# Altium schematic sheet buttons.SchDoc
size A3
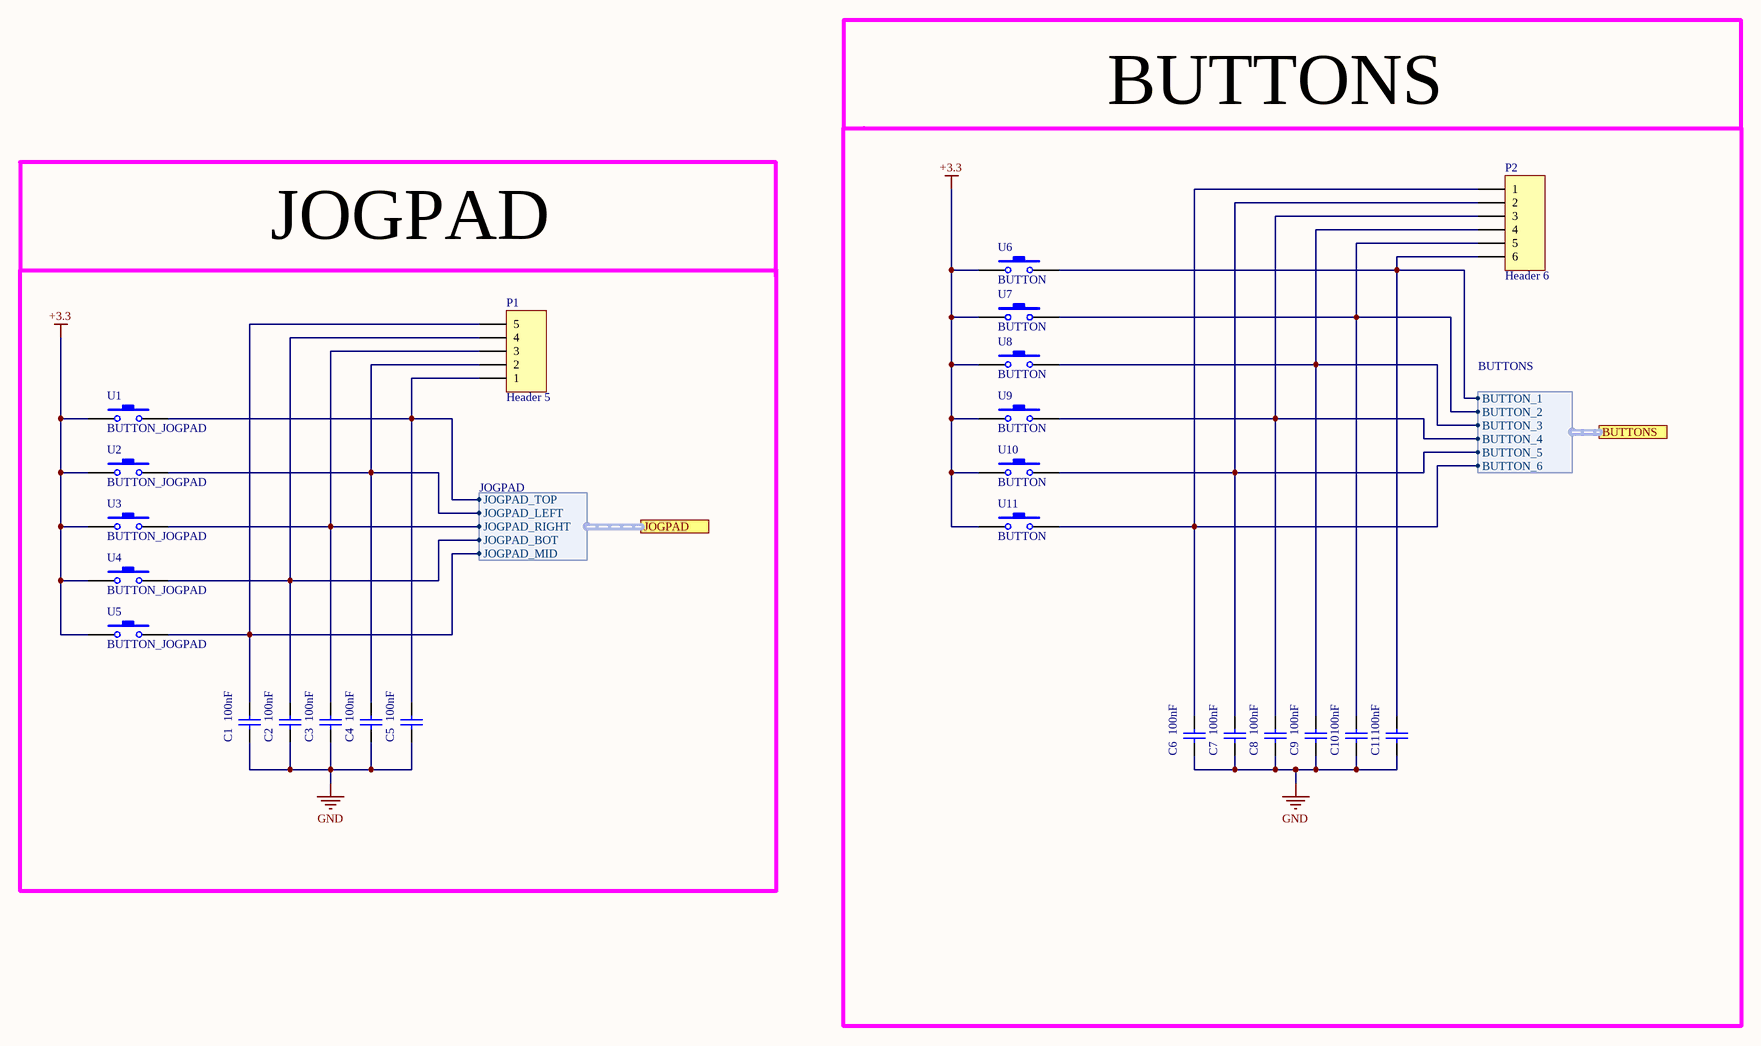
[diagram p0: buttons.SchDoc]

## Parts
C1  100nF  [CAP_0402i_1005m -N]
C2  100nF  [CAP_0402i_1005m -N]
C3  100nF  [CAP_0402i_1005m -N]
C4  100nF  [CAP_0402i_1005m -N]
C5  100nF  [CAP_0402i_1005m -N]
C6  100nF  [CAP_0402i_1005m -N]
C7  100nF  [CAP_0402i_1005m -N]
C8  100nF  [CAP_0402i_1005m -N]
C9  100nF  [CAP_0402i_1005m -N]
C10  100nF  [CAP_0402i_1005m -N]
C11  100nF  [CAP_0402i_1005m -N]
P1  Header 5  [HDR1X5]
P2  Header 6  [HDR1X6]
U1  BUTTON_JOGPAD  [JOGPAD_Button]
U2  BUTTON_JOGPAD  [JOGPAD_Button]
U3  BUTTON_JOGPAD  [JOGPAD_Button]
U4  BUTTON_JOGPAD  [JOGPAD_Button]
U5  BUTTON_JOGPAD  [JOGPAD_Button]
U6  BUTTON  [RND 210-00206]
U7  BUTTON  [RND 210-00206]
U8  BUTTON  [RND 210-00206]
U9  BUTTON  [RND 210-00206]
U10  BUTTON  [RND 210-00206]
U11  BUTTON  [RND 210-00206]

## Blocks framed on the sheet
BUTTONS: C6-C11 P2 U6-U11
JOGPAD: C1-C5 P1 U1-U5

## Ports
BUTTONS (harness BUTTONS), JOGPAD (harness JOGPAD)

## Harnesses
BUTTONS: BUTTON_4, BUTTON_5, BUTTON_3, BUTTON_2, BUTTON_1, BUTTON_6
JOGPAD: JOGPAD_TOP, JOGPAD_LEFT, JOGPAD_RIGHT, JOGPAD_BOT, JOGPAD_MID

## Nets
+3.3: U1.1 U2.1 U3.1 U4.1 U5.1 U6.1 U7.1 U8.1 U9.1 U10.1 U11.1
GND: C1.1 C2.1 C3.1 C4.1 C5.1 C6.1 C7.1 C8.1 C9.1 C10.1 C11.1
NetC1_2: C1.2 P1.5 U5.2 ; port JOGPAD.JOGPAD_MID
NetC2_2: C2.2 P1.4 U4.2 ; port JOGPAD.JOGPAD_BOT
NetC3_2: C3.2 P1.3 U3.2 ; port JOGPAD.JOGPAD_RIGHT
NetC4_2: C4.2 P1.2 U2.2 ; port JOGPAD.JOGPAD_LEFT
NetC5_2: C5.2 P1.1 U1.2 ; port JOGPAD.JOGPAD_TOP
NetC6_2: C6.2 P2.1 U11.2 ; port BUTTONS.BUTTON_6
NetC7_2: C7.2 P2.2 U10.2 ; port BUTTONS.BUTTON_5
NetC8_2: C8.2 P2.3 U9.2 ; port BUTTONS.BUTTON_4
NetC9_2: C9.2 P2.4 U8.2 ; port BUTTONS.BUTTON_3
NetC10_2: C10.2 P2.5 U7.2 ; port BUTTONS.BUTTON_2
NetC11_2: C11.2 P2.6 U6.2 ; port BUTTONS.BUTTON_1

## Notes on the sheet
- 1
- 2
- 3
- 4
- 5
- 6
- 7
- 8
- A
- B
- C
- D
- Project:
- Date:
- Drawing number:
- Rev:
- Format:
- A3
- Drawn by:
- Laboratory:
- Page
- Sheet:
- of
- File:

## Library data of the parts
C1-C11 = Cap: capacitor
P1 = Header 5: Header, 5-Pin
P2 = Header 6: Header, 6-Pin